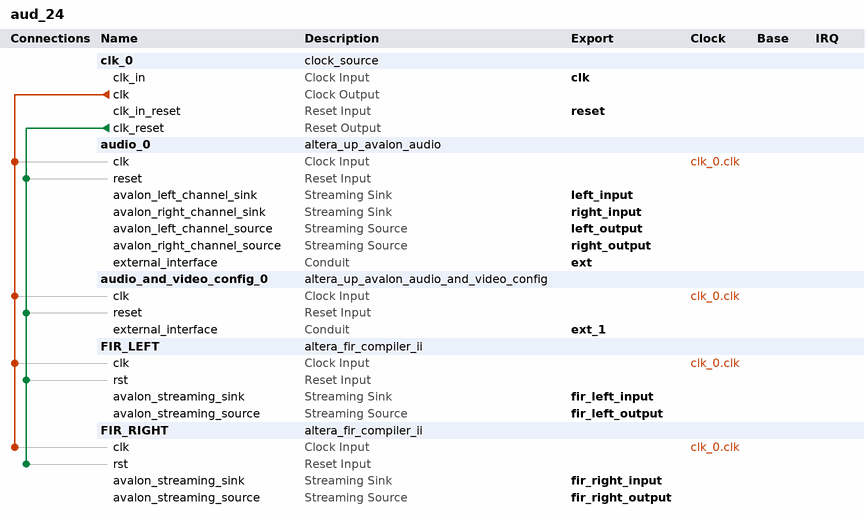
[diagram p0: system contents]
# Platform Designer (Qsys) system aud_24, Cyclone V 5CSEMA5F31C6
# Parameters at their usual value, and those the tool derives, are not listed.
package require -exact qsys 17.1
create_system aud_24
set_project_property DEVICE_FAMILY {Cyclone V}
set_project_property DEVICE 5CSEMA5F31C6

add_instance clk_0 clock_source 17.1
set_instance_parameter_value clk_0 clockFrequency 50000000

add_instance audio_0 altera_up_avalon_audio 17.1
set_instance_parameter_value audio_0 audio_in true
set_instance_parameter_value audio_0 avalon_bus_type Streaming
set_instance_parameter_value audio_0 dw 24

add_instance audio_and_video_config_0 altera_up_avalon_audio_and_video_config 17.1
set_instance_parameter_value audio_and_video_config_0 audio_in {Microphone to ADC}
set_instance_parameter_value audio_and_video_config_0 bit_length 24
set_instance_parameter_value audio_and_video_config_0 board DE1-SoC
set_instance_parameter_value audio_and_video_config_0 line_in_bypass false
set_instance_parameter_value audio_and_video_config_0 sampling_rate {48 kHz}

add_instance FIR_LEFT altera_fir_compiler_ii 17.1
set_instance_parameter_value FIR_LEFT coeffBitWidth 5
set_instance_parameter_value FIR_LEFT coeffFracBitWidth 0
set_instance_parameter_value FIR_LEFT coeffReload false
set_instance_parameter_value FIR_LEFT coeffType int
set_instance_parameter_value FIR_LEFT inputBitWidth 16
set_instance_parameter_value FIR_LEFT inputChannelNum 1
set_instance_parameter_value FIR_LEFT inputFracBitWidth 0
set_instance_parameter_value FIR_LEFT inputRate 0.048
set_instance_parameter_value FIR_LEFT inputType int
set_instance_parameter_value FIR_LEFT outLsbBitRem 3
set_instance_parameter_value FIR_LEFT outMsbBitRem 0
set_instance_parameter_value FIR_LEFT outType int
set_instance_parameter_value FIR_LEFT readWriteMode read_write
set_instance_parameter_value FIR_LEFT speedGrade medium

add_instance FIR_RIGHT altera_fir_compiler_ii 17.1
set_instance_parameter_value FIR_RIGHT coeffBitWidth 5
set_instance_parameter_value FIR_RIGHT coeffFracBitWidth 0
set_instance_parameter_value FIR_RIGHT coeffReload false
set_instance_parameter_value FIR_RIGHT coeffType int
set_instance_parameter_value FIR_RIGHT inputBitWidth 16
set_instance_parameter_value FIR_RIGHT inputChannelNum 1
set_instance_parameter_value FIR_RIGHT inputFracBitWidth 0
set_instance_parameter_value FIR_RIGHT inputRate 0.048
set_instance_parameter_value FIR_RIGHT inputType int
set_instance_parameter_value FIR_RIGHT outLsbBitRem 3
set_instance_parameter_value FIR_RIGHT outMsbBitRem 0
set_instance_parameter_value FIR_RIGHT outType int
set_instance_parameter_value FIR_RIGHT readWriteMode read_write
set_instance_parameter_value FIR_RIGHT speedGrade medium

# connections
add_connection clk_0.clk audio_0.clk clock
add_connection clk_0.clk audio_and_video_config_0.clk clock
add_connection clk_0.clk FIR_LEFT.clk clock
add_connection clk_0.clk FIR_RIGHT.clk clock
add_connection clk_0.clk_reset audio_0.reset reset
add_connection clk_0.clk_reset audio_and_video_config_0.reset reset
add_connection clk_0.clk_reset FIR_LEFT.rst reset
add_connection clk_0.clk_reset FIR_RIGHT.rst reset

# exported interfaces
add_interface clk clock sink
set_interface_property clk EXPORT_OF clk_0.clk_in
add_interface ext conduit end
set_interface_property ext EXPORT_OF audio_0.external_interface
add_interface ext_1 conduit end
set_interface_property ext_1 EXPORT_OF audio_and_video_config_0.external_interface
add_interface fir_left_input avalon_streaming sink
set_interface_property fir_left_input EXPORT_OF FIR_LEFT.avalon_streaming_sink
add_interface fir_left_output avalon_streaming source
set_interface_property fir_left_output EXPORT_OF FIR_LEFT.avalon_streaming_source
add_interface fir_right_input avalon_streaming sink
set_interface_property fir_right_input EXPORT_OF FIR_RIGHT.avalon_streaming_sink
add_interface fir_right_output avalon_streaming source
set_interface_property fir_right_output EXPORT_OF FIR_RIGHT.avalon_streaming_source
add_interface left_input avalon_streaming sink
set_interface_property left_input EXPORT_OF audio_0.avalon_left_channel_sink
add_interface left_output avalon_streaming source
set_interface_property left_output EXPORT_OF audio_0.avalon_left_channel_source
add_interface reset reset sink
set_interface_property reset EXPORT_OF clk_0.clk_in_reset
add_interface right_input avalon_streaming sink
set_interface_property right_input EXPORT_OF audio_0.avalon_right_channel_sink
add_interface right_output avalon_streaming source
set_interface_property right_output EXPORT_OF audio_0.avalon_right_channel_source

set_interconnect_requirement {$system} qsys_mm.clockCrossingAdapter HANDSHAKE
set_interconnect_requirement {$system} qsys_mm.enableEccProtection FALSE
set_interconnect_requirement {$system} qsys_mm.insertDefaultSlave FALSE
set_interconnect_requirement {$system} qsys_mm.maxAdditionalLatency 1

save_system aud_24.qsys
